# Altium schematic sheet FIT_HDMI_X24-20.SchDoc: FIT_PM12 board
size 420 x 297 mm; CheckedBy: G.Kasprowicz; Author: INR Moscow; CompanyName: WUT ISE; DrawnBy: M.Podgórski; Organization: WUT ISE; Address1: PW ISE; Address2: Nowowiejska 15/19 00-665 Warsaw; Address3: gkasprow@gmail.com; Revision: 2; SheetNumber: -; SheetTotal: -; ModifiedBy: -; CheckedDate: -; Title2: Title 2; DivGrp: WUT ISE; Designer: INR RAS; ModifiedDate: -; ProjectName: Sensor Box
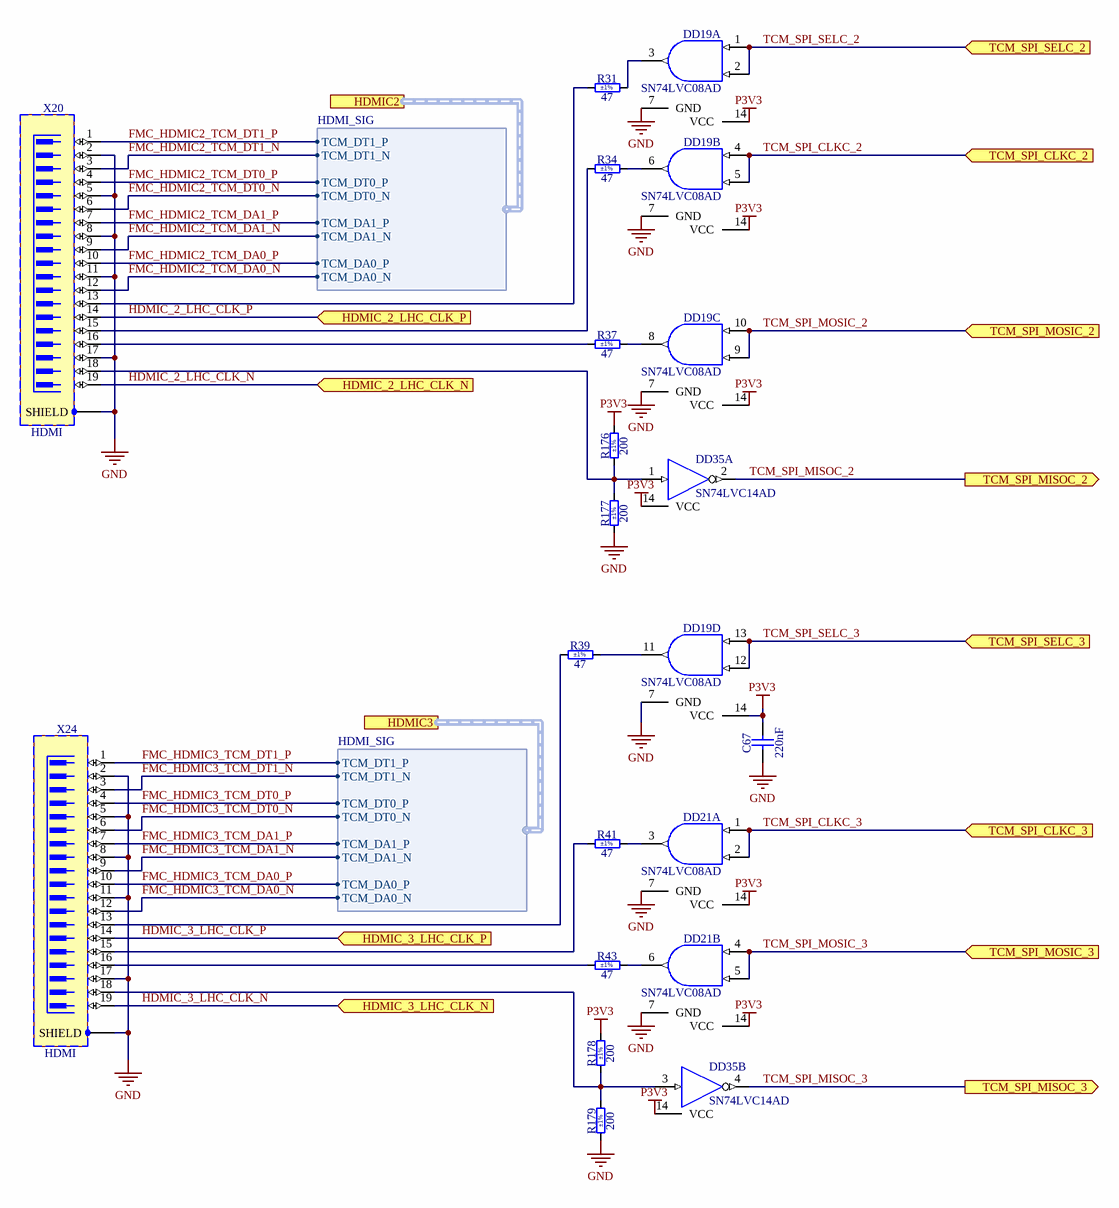
[diagram p0: FIT_HDMI_X24-20.SchDoc]

## Parts
C67  220nF  [CAPC2012X135N]
DD19  SN74LVC08AD  [SOIC127P600X175-14N]  (parts A,B,C,D of 4)
DD21  SN74LVC08AD  [SOIC127P600X175-14N]  (parts A,B of 4)
DD35  SN74LVC14AD  [SOIC127P600X175-14N]  (parts A,B of 6)
R31  47  Tolerance: ±1%  [RESC2012X60N]
R34  47  Tolerance: ±1%  [RESC2012X60N]
R37  47  Tolerance: ±1%  [RESC2012X60N]
R39  47  Tolerance: ±1%  [RESC2012X60N]
R41  47  Tolerance: ±1%  [RESC2012X60N]
R43  47  Tolerance: ±1%  [RESC2012X60N]
R176  200  Tolerance: ±1%  [RESC2012X60N]
R177  200  Tolerance: ±1%  [RESC2012X60N]
R178  200  Tolerance: ±1%  [RESC2012X60N]
R179  200  Tolerance: ±1%  [RESC2012X60N]
X20  HDMI  [TYCO_2007435-1]
X24  HDMI  [TYCO_2007435-1]

## Ports
HDMIC2 (harness HDMI_SIG), HDMIC3 (harness HDMI_SIG), HDMIC_2_LHC_CLK_N (in), HDMIC_2_LHC_CLK_P (in), HDMIC_3_LHC_CLK_N (in), HDMIC_3_LHC_CLK_P (in), TCM_SPI_CLKC_2 (in), TCM_SPI_CLKC_3 (in), TCM_SPI_MISOC_2 (out), TCM_SPI_MISOC_3 (out), TCM_SPI_MOSIC_2 (in), TCM_SPI_MOSIC_3 (in), TCM_SPI_SELC_2 (in), TCM_SPI_SELC_3 (in)

## Harnesses
HDMI_SIG: TCM_DT1_P, TCM_DT1_N, TCM_DT0_P, TCM_DT0_N, TCM_DA1_P, TCM_DA1_N, TCM_DA0_P, TCM_DA0_N

## Nets
GND: C67.1 DD19.7(GND) DD21.7(GND) DD35.7(GND) R177.1 R179.1 X20.2 X20.5 X20.8 X20.11 X20.17 X20.SHIELD X24.2 X24.5 X24.8 X24.11 X24.17 X24.SHIELD
P3V3: C67.2 DD19.14(VCC) DD21.14(VCC) DD35.14(VCC) R176.2 R178.2  [also labelled VCC]
FMC_HDMIC2_TCM_DA0_N: X20.12 ; port HDMIC2.TCM_DA0_N
FMC_HDMIC2_TCM_DA0_P: X20.10 ; port HDMIC2.TCM_DA0_P
FMC_HDMIC2_TCM_DA1_N: X20.9 ; port HDMIC2.TCM_DA1_N
FMC_HDMIC2_TCM_DA1_P: X20.7 ; port HDMIC2.TCM_DA1_P
FMC_HDMIC2_TCM_DT0_N: X20.6 ; port HDMIC2.TCM_DT0_N
FMC_HDMIC2_TCM_DT0_P: X20.4 ; port HDMIC2.TCM_DT0_P
FMC_HDMIC2_TCM_DT1_N: X20.3 ; port HDMIC2.TCM_DT1_N
FMC_HDMIC2_TCM_DT1_P: X20.1 ; port HDMIC2.TCM_DT1_P
FMC_HDMIC3_TCM_DA0_N: X24.12 ; port HDMIC3.TCM_DA0_N
FMC_HDMIC3_TCM_DA0_P: X24.10 ; port HDMIC3.TCM_DA0_P
FMC_HDMIC3_TCM_DA1_N: X24.9 ; port HDMIC3.TCM_DA1_N
FMC_HDMIC3_TCM_DA1_P: X24.7 ; port HDMIC3.TCM_DA1_P
FMC_HDMIC3_TCM_DT0_N: X24.6 ; port HDMIC3.TCM_DT0_N
FMC_HDMIC3_TCM_DT0_P: X24.4 ; port HDMIC3.TCM_DT0_P
FMC_HDMIC3_TCM_DT1_N: X24.3 ; port HDMIC3.TCM_DT1_N
FMC_HDMIC3_TCM_DT1_P: X24.1 ; port HDMIC3.TCM_DT1_P
HDMIC_2_LHC_CLK_N: X20.19 ; port HDMIC_2_LHC_CLK_N
HDMIC_2_LHC_CLK_P: X20.14 ; port HDMIC_2_LHC_CLK_P
HDMIC_3_LHC_CLK_N: X24.19 ; port HDMIC_3_LHC_CLK_N
HDMIC_3_LHC_CLK_P: X24.14 ; port HDMIC_3_LHC_CLK_P
TCM_SPI_CLKC_2: DD19.4(A) DD19.5(B) ; port TCM_SPI_CLKC_2
TCM_SPI_CLKC_3: DD21.1(A) DD21.2(B) ; port TCM_SPI_CLKC_3
TCM_SPI_MISOC_2: DD35.2(OUT) ; port TCM_SPI_MISOC_2
TCM_SPI_MISOC_3: DD35.4(OUT) ; port TCM_SPI_MISOC_3
TCM_SPI_MOSIC_2: DD19.9(B) DD19.10(A) ; port TCM_SPI_MOSIC_2
TCM_SPI_MOSIC_3: DD21.4(A) DD21.5(B) ; port TCM_SPI_MOSIC_3
TCM_SPI_SELC_2: DD19.1(A) DD19.2(B) ; port TCM_SPI_SELC_2
TCM_SPI_SELC_3: DD19.12(B) DD19.13(A) ; port TCM_SPI_SELC_3
NetDD19_3: DD19.3(Y) R31.2
NetDD19_6: DD19.6(Y) R34.2
NetDD19_8: DD19.8(Y) R37.2
NetDD19_11: DD19.11(Y) R39.2
NetDD21_3: DD21.3(Y) R41.2
NetDD21_6: DD21.6(Y) R43.2
NetDD35_1: DD35.1(IN) R176.1 R177.2 X20.18
NetDD35_3: DD35.3(IN) R178.1 R179.2 X24.18
NetR31_1: R31.1 X20.13
NetR34_1: R34.1 X20.15
NetR37_1: R37.1 X20.16
NetR39_1: R39.1 X24.13
NetR41_1: R41.1 X24.15
NetR43_1: R43.1 X24.16

## Notes on the sheet
- Project/Equipment
- Document
- Designer
- Drawn by
- Check.by
- Copyright WUT ISE 2024.
  This documentation describes Open Hardware and is licensed under the CERN OHL v.2. You may redistribute and modify this documentation under the terms of the CERN OHL v.2. (http://ohwr.org/CERNOHL). This documentation is distributed WITHOUT ANY EXPRESS OR IMPLIED WARRANTY, INCLUDING OF MERCHANTABILITY, SATISFACTORY QUALITY AND FITNESS FOR A PARTICULAR PURPOSE. Please see the CERN OHL v.2 for applicable conditions.
- Contact
- File
- Last Mod.
- Print Date
- Sheet
- Size
- A3
- of
- Rev

## Library data of the parts
C67 = CC0805_220NF_50V_10%_X7R: Non-polarised capacitor; Part Description: SMD Multilayer Chip Ceramic Capacitor; Manufacturer: GENERIC; Manufacturer1 Part Number: GRM21BR71H224KA01L; Voltage: 50V; TC: X7R; Tolerance: ±10%; Part Number: CC0805_220NF_50V_10%_X7R; Component Kind: Standard; Component Type: Standard; Pin Count: 2; Value: 220nF; Status: Preferred; Manufacturer Part Number: CC0805_220NF_50V_10%_X7R; Case: 0805; Mounted: Yes; Socket: No; SMD: Yes; Sense: No; Manufacturer1 Example: MURATA; Manufacturer1 ComponentHeight: 1.35mm; HelpURL: \\cern.ch\dfs\Applications\Altium\Datasheets\CC0805_X7R_MURATA.pdf; Author: CERN DEM JLC; CreateDate: 03.12.2007; LatestRevisionDate: 03.12.2007
DD19 DD21 = SN74LVC08AD: Quad 2-Input AND Gate; Part Description: Quadruple 2-Input Positive-AND Gate; Manufacturer: TEXAS INSTRUMENTS; PressFit: No; Bonding: No; Part Number: SN74LVC08AD; Component Kind: Standard; Component Type: Standard; Device: SN74LVC08AD; PackageDescription: SOIC 14, Pitch 1.27mm - Body 4x8.75mm, IPC Medium Density; Manufacturer Part Number: SN74LVC08AD; Pin Count: 14; Case: SOIC14; Mounted: Yes; Socket: No; SMD: Yes; Sense: No; ComponentHeight: 1.75mm; Author: CERN DEM JLC; HelpURL: \\cern.ch\dfs\Applications\Altium\Datasheets\SN74LVC08AD.pdf; CreateDate: 21.03.2012; LatestRevisionDate: 21.03.2012
DD35 = SN74LVC14AD: Hex Schmitt-Trigger Inverter; Manufacturer: TEXAS INSTRUMENTS; PressFit: No; Bonding: No; Part Number: SN74LVC14AD; Component Kind: Standard; Component Type: Standard; Device: SN74LVC14AD; PackageDescription: SOIC 14, Pitch 1.27mm - Body 4x8.75mm, IPC Medium Density; Part Description: Hex Schmitt-Trigger Inverter; Manufacturer Part Number: SN74LVC14AD; Pin Count: 14; Case: SOIC14; Mounted: Yes; Socket: No; SMD: Yes; Sense: No; ComponentHeight: 1.75mm; Author: CERN DEM JMW; HelpURL: \\cern.ch\dfs\Applications\Altium\Datasheets\SN74LVC14AD.pdf; CreateDate: 29.09.2008; LatestRevisionDate: 29.09.2008
R31 R34 R37 R39 R41 R43 = R0805_47R_1%_0.125W_100PPM: Resistor - 1%; Part Description: General Purpose Thick Film Chip Resistor; Manufacturer: GENERIC; Manufacturer1 Part Number: NRC10F47R0TRF; Power: 0.125W; TC: ±100ppm/°C; PressFit: No; Part Number: R0805_47R_1%_0.125W_100PPM; Component Kind: Standard; Component Type: Standard; Pin Count: 2; Value: 47; Status: Preferred; Manufacturer Part Number: R0805_47R_1%_0.125W_100PPM; Case: 0805; Mounted: Yes; Sense: No; Socket: No; SMD: Yes; Manufacturer1 Example: NIC COMPONENT; Manufacturer1 ComponentHeight: 0.6mm; HelpURL: \\cern.ch\dfs\Applications\Altium\Datasheets\R0805_NIC_NRC.pdf; Author: CERN DEM JLC; CreateDate: 03.12.2007; LatestRevisionDate: 13.03.2008
R176-R179 = R0805_200R_1%_0.125W_100PPM: Resistor - 1%; Part Description: General Purpose Thick Film Chip Resistor; Manufacturer: GENERIC; Manufacturer1 Part Number: NRC10F2000TRF; Power: 0.125W; TC: ±100ppm/°C; PressFit: No; Part Number: R0805_200R_1%_0.125W_100PPM; Component Kind: Standard; Component Type: Standard; Pin Count: 2; Value: 200; Status: Preferred; Manufacturer Part Number: R0805_200R_1%_0.125W_100PPM; Case: 0805; Mounted: Yes; Sense: No; Socket: No; SMD: Yes; Manufacturer1 Example: NIC COMPONENT; Manufacturer1 ComponentHeight: 0.6mm; HelpURL: \\cern.ch\dfs\Applications\Altium\Datasheets\R0805_NIC_NRC.pdf; Author: CERN DEM JLC; CreateDate: 03.12.2007; LatestRevisionDate: 13.03.2008
X20 X24 = TYCO_2007435-1: Connector HDMI 19 Male + 1 Shield; Part Description: 0.578mm Pitch, Through-Hole Right Angle 19 Contacts Flag-HDMI Type-A Receptacle Thru Hole Mounting Pads; Manufacturer: TYCO ELECTRONICS; PressFit: No; Part Number: TYCO_2007435-1; Component Kind: Standard; Component Type: Standard; Pin Count: 23; Family: HDMI; Mounted: Yes; Socket: No; SMD: No; Sense: No; Status: None; Manufacturer Part Number: 2007435-1; ComponentHeight: 16.4mm; HelpURL: \\cern.ch\dfs\Applications\Altium\Datasheets\TYCO_2007435-1.pdf; Author: CERN DEM MR; CreateDate: 05.07.2016; LatestRevisionDate: 05.07.2016